# Altium schematic sheet Elreg_Sender.SchDoc
size A; SheetNumber: 2
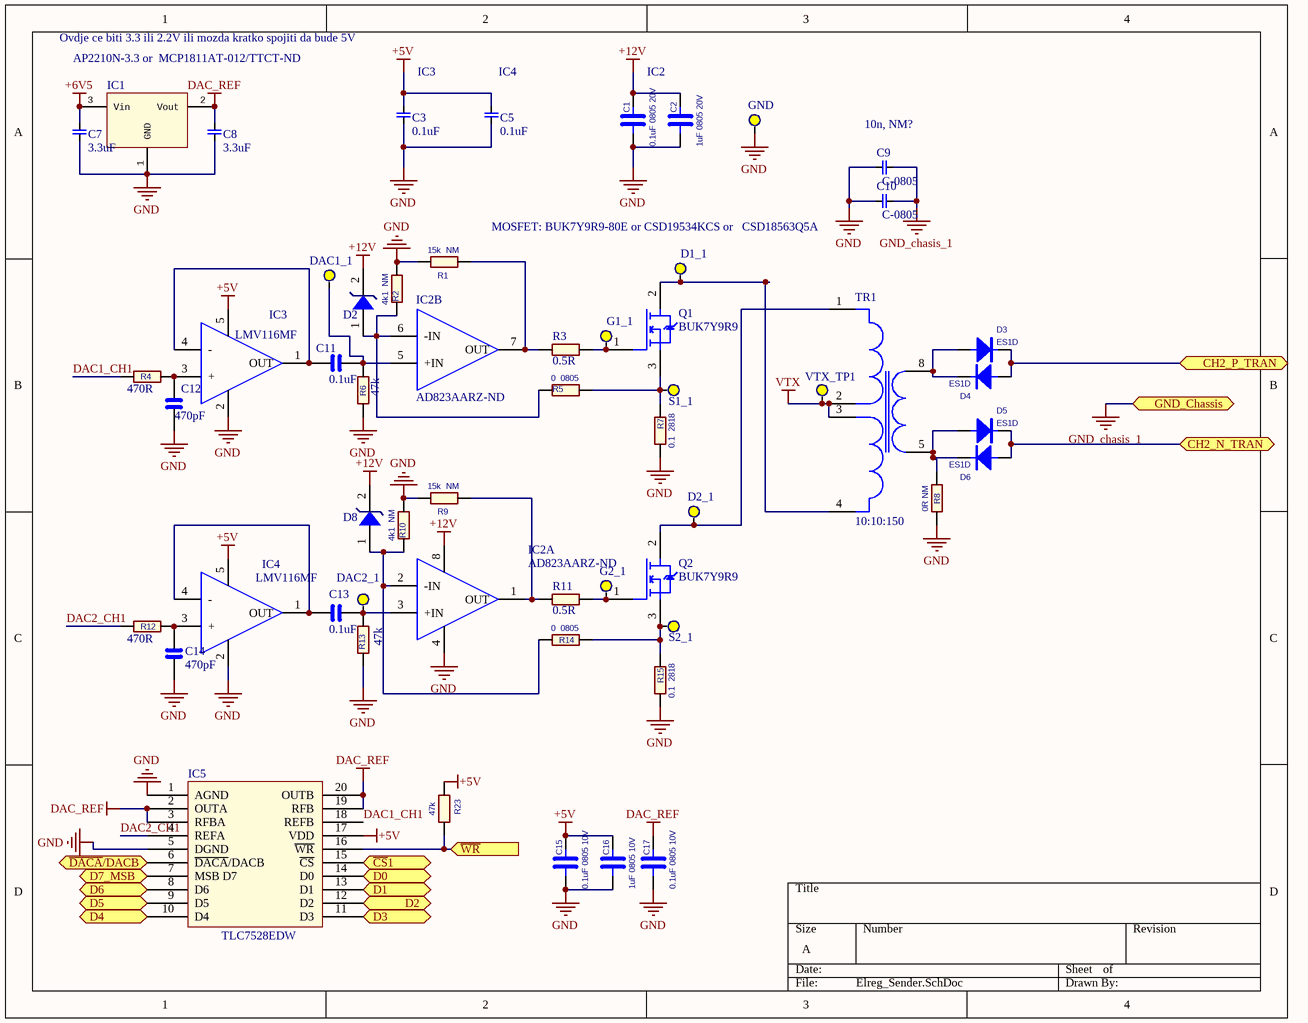
[diagram p0: Elreg_Sender.SchDoc]

## Parts
C1  0.1uF 0805 20V  [C-0603]
C2  1uF 0805 20V  [C-0603]
C3  0.1uF  [C-0603]
C5  0.1uF  [C-0603]
C7  3.3uF  [C-0805]
C8  3.3uF  [C-0805]
C9  C-0805  [C-0805]
C10  C-0805  [C-0805]
C11  0.1uF  [C-0603]
C12  470pF  [C-0603]
C13  0.1uF  [C-0603]
C14  470pF  [C-0603]
C15  0.1uF 0805 10V  [C-0603]
C16  1uF 0805 10V  [C-0603]
C17  0.1uF 0805 10V  [C-0603]
D1_1  Test_Point  [Test_Point]  (value not drawn)
D2  Zener 12V  [DFN380P520X45-2N]  (value not drawn)
D2_1  Test_Point  [Test_Point]  (value not drawn)
D3  ES1D  [SMA]
D4  ES1D  [SMA]
D5  ES1D  [SMA]
D6  ES1D  [SMA]
D8  Zener 12V  [DFN380P520X45-2N]  (value not drawn)
DAC1_1  DAC1  [Test_Point]  (value not drawn)
DAC2_1  DAC2_1  [Test_Point]  (value not drawn)
G1_1  Test_Point  [Test_Point]  (value not drawn)
G2_1  Test_Point  [Test_Point]  (value not drawn)
IC1  AP2210N-3.3 or  MCP1811AT-012/TTCT-ND  [SOT23-3]
IC2  AD823AARZ-ND  [TSOP65P280X110-8N]  (parts A,B of 2)
IC3  LMV116MF  [SOT-23-5]
IC4  LMV116MF  [SOT-23-5]
IC5  TLC7528EDW  [SOIC-20]
Q1  BUK7Y9R9  [BUK7Y9R)]
Q2  BUK7Y9R9  [BUK7Y9R)]
R1  15k  NM  [R-0603]
R2  4k1  NM  [R-0603]
R3  0.5R  [R-0603]
R4  470R  [R-0603]
R5  0  0805  [R-0603]
R6  47k  [R-0603]
R7  0.1  2818  [RES2818]
R8  0R NM  [RES-0805]
R9  15k  NM  [R-0603]
R10  4k1  NM  [R-0603]
R11  0.5R  [R-0603]
R12  470R  [R-0603]
R13  47k  [R-0603]
R14  0  0805  [R-0603]
R15  0.1  2818  [RES2818]
R23  47k  [R-0603]
S1_1  Test_Point  [Test_Point]  (value not drawn)
S2_1  Test_Point  [Test_Point]  (value not drawn)
TP1  GND  [Test_Point]
TR1  10:10:150  [Trafo_15x15]
VTX_TP1  Test_Point  [Test_Point]  (value not drawn)

## Ports
CH2_N_TRAN (bidir), CH2_P_TRAN (bidir), D0 (in), D1 (in), D2 (in), D3 (in), D4 (in), D5 (in), D6 (in), D7_MSB (in), GND_Chassis (bidir), ~{CS}1 (in), ~{DACA}/DACB (in), ~{WR} (in)

## Nets
+5V: C3.2(G) C5.2(G) C15.2 C16.2 IC3.5(+Vs) IC4.5(+Vs) IC5.17(VDD) R23.2
+6V5: C7.2(G) IC1.3(Vin)
+12V: C1.2 C2.2 D2.2(A) D8.2(A) IC2.8(+Vs)
DAC_REF: C8.2(G) C17.2 IC1.2(Vout) IC5.2(OUTA) IC5.3(RFBA) IC5.19(RFB) IC5.20(OUTB)
GND: C1.1 C2.1 C3.1(G) C5.1(G) C7.1(G) C8.1(G) C9.1(G) C10.1(G) C12.2 C14.1 C15.1 C16.1 C17.1 IC1.1(GND) IC2.4(-Vs) IC3.2(-Vs) IC4.2(-Vs) IC5.1(AGND) IC5.5(DGND) R1.1 R2.2 R6.1 R7.2 R8.1 R9.1 R10.2 R13.2 R15.2 TP1.1
GND_chasis_1: C9.2(G) C10.2(G) ; port GND_Chassis
VTX: TR1.2(G) TR1.3(G) VTX_TP1.1
~{CS}1: IC5.15(~{CS}) ; port ~{CS}1
~{DACA}/DACB: IC5.6(~{DACA}/DACB) ; port ~{DACA}/DACB
~{WR}: IC5.16(~{WR}) R23.1 ; port ~{WR}
CH2_N_TRAN: D5.2(C) D6.1(A) ; port CH2_N_TRAN
CH2_P_TRAN: D3.2(C) D4.1(A) ; port CH2_P_TRAN
D0: IC5.14(D0) ; port D0
D1: IC5.13(D1) ; port D1
D2: IC5.12(D2) ; port D2
D3: IC5.11(D3) ; port D3
D4: IC5.10(D4) ; port D4
D5: IC5.9(D5) ; port D5
D6: IC5.8(D6) ; port D6
D7_MSB: IC5.7(MSB_D7) ; port D7_MSB
DAC1_CH1: IC5.18(REFB) R4.1
DAC2_CH1: IC5.4(REFA) R12.1
NetC11_1: C11.1 DAC1_1.1 IC2.5(+IN) R6.2
NetC11_2: C11.2 IC3.1(OUT) IC3.4(-)
NetC12_1: C12.1 IC3.3(+) R4.2
NetC13_1: C13.1 DAC2_1.1 IC2.3(+IN) R13.1
NetC13_2: C13.2 IC4.1(OUT) IC4.4(-)
NetC14_2: C14.2 IC4.3(+) R12.2
NetD1_1_1: D1_1.1 Q1.2(G) TR1.4(G)
NetD2_1: D2.1(A) IC2.6(-IN) R2.1 R5.1
NetD2_1_1: D2_1.1 Q2.2(G) TR1.1(G)
NetD3_1: D3.1(A) D4.2(C) TR1.8(G)
NetD5_1: D5.1(A) D6.2(C) R8.2 TR1.5(G)
NetD8_1: D8.1(A) IC2.2(-IN) R10.1 R14.1
NetG1_1_1: G1_1.1 Q1.1(G) R3.2
NetG2_1_1: G2_1.1 Q2.1(G) R11.2
NetIC2_1: IC2.1(OUT) R9.2 R11.1
NetIC2_7: IC2.7(OUT) R1.2 R3.1
NetQ1_3: Q1.3(G) R5.2 R7.1 S1_1.1
NetQ2_3: Q2.3(G) R14.2 R15.1 S2_1.1

## Notes on the sheet
- Ovdje ce biti 3.3 ili 2.2V ili mozda kratko spojiti da bude 5V
- (near C3) IC3
- (near C5) IC4
- IC2
- (near C9) 10n, NM?
- MOSFET: BUK7Y9R9-80E or CSD19534KCS or   CSD18563Q5A

## Library data of the parts
C1 C2 C15-C17 = 0805CAPxxrrrrv: CAP CER rrrrUF xV x% type 0805
C3 C5 C7 C8 = C-0805_3_3uF: Manufacturer 1: Yageo; Manufacturer Part Number 1: CC1206KKX7RBBB332; Tolerance: ±10%; Voltage - Rated: 500V; Temperature Coefficient: X7R; Notification: Current market demand for these product types have resulted in fluctuating and extending lead times. Lead times may differ.; Description 1: CAP CER 3300PF 500V X7R 1206; Category 1: Capacitors; Packaging: Cut Tape (CT); Part Status: Active; Operating Temperature: -55°C ~ 125°C; Features: -; Ratings: -; Applications: General Purpose; Failure Rate: -; Mounting Type: Surface Mount, MLCC; Package / Case: 1206 (3216 Metric); Size / Dimension: 0.126" L x 0.063" W (3.20mm x 1.60mm); Height - Seated (Max): -; Thickness (Max): 0.057" (1.45mm); Lead Spacing: -; Lead Style: -; ComponentLink1URL: http://www.yageo.com/documents/recent/UPY-NP0X7R_MV_100-to-630V_21.pdf; ComponentLink1Description: http://www.yageo.com/documents/recent/UPY-NP0X7R_MV_100-to-630V_21.pdf; Supplier 1: Digi-Key; Supplier Part Number 1: 311-1506-1-ND; RoHS 1: RoHS Compliant; Stock 1: 4928; Pricing 1: 1=0.31, 10=0.214, 100=0.1085, 500=0.07424, 1000=0.06568 (USD)
C9 C10 = C-0805: Manufacturer 1: Yageo; Manufacturer Part Number 1: CC1206KKX7RBBB332; Tolerance: ±10%; Voltage - Rated: 500V; Temperature Coefficient: X7R; Notification: Current market demand for these product types have resulted in fluctuating and extending lead times. Lead times may differ.; Description 1: CAP CER 3300PF 500V X7R 1206; Category 1: Capacitors; Packaging: Cut Tape (CT); Part Status: Active; Operating Temperature: -55°C ~ 125°C; Features: -; Ratings: -; Applications: General Purpose; Failure Rate: -; Mounting Type: Surface Mount, MLCC; Package / Case: 1206 (3216 Metric); Size / Dimension: 0.126" L x 0.063" W (3.20mm x 1.60mm); Height - Seated (Max): -; Thickness (Max): 0.057" (1.45mm); Lead Spacing: -; Lead Style: -; ComponentLink1URL: http://www.yageo.com/documents/recent/UPY-NP0X7R_MV_100-to-630V_21.pdf; ComponentLink1Description: http://www.yageo.com/documents/recent/UPY-NP0X7R_MV_100-to-630V_21.pdf; Supplier 1: Digi-Key; Supplier Part Number 1: 311-1506-1-ND; RoHS 1: RoHS Compliant; Stock 1: 4928; Pricing 1: 1=0.31, 10=0.214, 100=0.1085, 500=0.07424, 1000=0.06568 (USD)
C11 C13 = C-0603_0_1u_10V: CAP CER 0.1UF 10V X7R 0603; Manufacturer Part Number: 885012206020
C12 C14 = C-0603_470p_10V: CAP CER 470p 10V C0G/NP0 0603; Manufacturer Part Number: 885012006014
D2 D8 = Zener 12V: Manufacturer 1: Comchip Technology; Manufacturer Part Number 1: CDBA140-G; Description 1: DIODE SCHOTTKY 40V 1A DO214AC; Category 1: Discrete Semiconductor Products; Diode Type: Schottky; Current - Average Rectified (Io): 1A; Speed: Fast Recovery =< 500ns, > 200mA (Io); Supplier 1: Digi-Key; Supplier Part Number 1: 641-1015-1-ND; RoHS 1: RoHS Compliant; Stock 1: 527910; Pricing 1: 1=0.37, 10=0.338, 100=0.1893, 500=0.1014, 1000=0.06895 (USD); Packaging: Cut Tape (CT); Part Status: Active; Capacitance @ Vr, F: -; Mounting Type: Surface Mount; Package / Case: DO-214AC, SMA; Supplier Device Package: DO-214AC (SMA); Operating Temperature - Junction: -65°C ~ 125°C; Base Part Number: CDBA140; ComponentLink1URL: http://www.comchiptech.com/admin/files/product/CDBA140-HF%20Thru192841.%20CDBA1100-HF%20RevB.pdf; ComponentLink1Description: http://www.comchiptech.com/admin/files/product/CDBA140-HF%20Thru192841.%20CDBA1100-HF%20RevB.pdf
D3-D6 = ES1x: Diode; Manufacturer: Fairchild/ON Semiconductor; Diode Type: Standard; Voltage - DC Reverse (Vr) (Max): 200V; Current - Average Rectified (Io): 1A; Voltage - Forward (Vf) (Max) @ If: 920mV @ 1A; Speed: Fast Recovery =< 500ns, > 200mA (Io); Reverse Recovery Time (trr): 15ns; Current - Reverse Leakage @ Vr: 5μA @ 200V; Capacitance @ Vr, F: 7pF @ 4V, 1MHz; Supplier 1: Digi-Key; Supplier Part Number 1: ES1DFSTR-ND; Manufacturer Part Number: ES1D; RoHS: RoHS Compliant; Category: Discrete Semiconductor Products; Stock 1: 135000; Pricing 1: 7500=0.0567, 15000=0.0504, 37500=0.04725, 52500=0.0419, 187500=0.04032 (USD); Packaging: Tape & Reel (TR); Part Status: Active; Mounting Type: Surface Mount; Package / Case: DO-214AC, SMA; Supplier Device Package: SMA (DO-214AC); Operating Temperature - Junction: -55°C ~ 150°C; ComponentLink1URL: https://www.fairchildsemi.com/datasheets/ES/ES1A.pdf; ComponentLink1Description: https://www.fairchildsemi.com/datasheets/ES/ES1A.pdf
DAC1_1 DAC2_1 TP1 = Test_Point
IC1 = AP2210N-3.3: AP2210N-3.3TRG1DICT-ND
IC2 = AD823AARZ-ND: IC OPAMP JFET 16MHZ RRO 8-MSOP; Supplier 1: Digi-Key; Supplier Part Number 1: AD823ARZ-ND
R1 R2 R5 R8-R10 R14 R23 = CRCW0805xxxxJN Default: RES xx OHM 1/8W 5% 0805 SMD; Category 1: Resistors
R3 R11 = RES-0805
R4 R12 = R-0603_470R: RES SMD 470 OHM 1% 0.4W 0805; Manufacturer 1: Vishay Dale; Manufacturer Part Number 1: CRCW0805150RJNEA; Manufacturer Part Number: ESR10EZPF1001; Description 1: RES 150 OHM 1/8W 5% 0805 SMD; Category 1: Resistors; Tolerance: ±5%; Power (Watts): 0.125W, 1/8W; Temperature Coefficient: ±200ppm/°C; Description 2: Thick Film Resistors - SMD 1/8watt 150ohms 5% 200ppm; Category 2: Thick Film Resistors - SMD; Power Rating: 125 mW (1/8 W); Resistance: 150 Ohms; Voltage Rating: 150 V; Description 3: VISHAY DALE - CRCW0805150RJNEA - RESISTOR, THICK FILM, 150 OHM, 125mW, 5%; Product Range: VISHAY - CRCW Series; Resistance Tolerance: ± 5%; Resistor Case Style: 0805 ^2012 Metric]; Resistor Element Type: Thick Film; No. of Pins: 2; Resistance (Ohms): 150; Supplier 1: Digi-Key; Supplier Part Number 1: 541-150ADKR-ND; RoHS 1: RoHS Compliant; Packaging: Digi-Reel®; Composition: Thick Film; Features: Automotive AEC-Q200 Qualified; Package / Case: 0805 (2012 Metric); Supplier Device Package: 0805 (2012 Metric); Size / Dimension: 0.079" L x 0.049" W (2.00mm x 1.25mm); Height: 0.020" (0.50mm); ComponentLink1URL: http://www.vishay.com/doc?20035; ComponentLink1Description: http://www.vishay.com/doc?20035; Supplier 2: Mouser; Supplier Part Number 2: 71-CRCW0805150RJNEA; Manufacturer 2: Vishay; Manufacturer Part Number 2: CRCW0805150RJNEA; RoHS 2: RoHS Compliant By Exemption; Dimensions: 1.25 mm W x 2 mm L x 0.45 mm H; Operating Temperature Range: - 55 C to + 155 C; Product: Thick Film Resistors SMD; Series: CRCW; Termination Style: SMD/SMT; Case Code - in: 0805; Case Code - mm: 2012; Product Category: 0805 Thick Film Chip Resistors; Standard Pack Qty: 5000; RoHS - Mouser: E; Minimum Order Quantity: 1; Reeling: True; ComponentLink2URL: http://www.mouser.com/ds/2/427/dcrcwe3-109170.pdf; ComponentLink2Description: http://www.mouser.com/ds/2/427/dcrcwe3-109170.pdf; Supplier 3: Farnell; Supplier Part Number 3: 1514819; Manufacturer 3: VISHAY DALE; Manufacturer Part Number 3: CRCW0805150RJNEA; RoHS 3: YES; ComponentLink3URL: http://www.farnell.com/cad/1552534.zip; ComponentLink3Description: http://www.farnell.com/cad/1552534.zip
R6 R13 = R-0603_47k: RES SMD 47k 1% 0.4W 0805; Manufacturer 1: Vishay Dale; Manufacturer Part Number 1: CRCW0805150RJNEA; Manufacturer Part Number: ESR10EZPF1001; Description 1: RES 150 OHM 1/8W 5% 0805 SMD; Category 1: Resistors; Tolerance: ±5%; Power (Watts): 0.125W, 1/8W; Temperature Coefficient: ±200ppm/°C; Description 2: Thick Film Resistors - SMD 1/8watt 150ohms 5% 200ppm; Category 2: Thick Film Resistors - SMD; Power Rating: 125 mW (1/8 W); Resistance: 150 Ohms; Voltage Rating: 150 V; Description 3: VISHAY DALE - CRCW0805150RJNEA - RESISTOR, THICK FILM, 150 OHM, 125mW, 5%; Product Range: VISHAY - CRCW Series; Resistance Tolerance: ± 5%; Resistor Case Style: 0805 ^2012 Metric]; Resistor Element Type: Thick Film; No. of Pins: 2; Resistance (Ohms): 150; Supplier 1: Digi-Key; Supplier Part Number 1: 541-150ADKR-ND; RoHS 1: RoHS Compliant; Packaging: Digi-Reel®; Composition: Thick Film; Features: Automotive AEC-Q200 Qualified; Package / Case: 0805 (2012 Metric); Supplier Device Package: 0805 (2012 Metric); Size / Dimension: 0.079" L x 0.049" W (2.00mm x 1.25mm); Height: 0.020" (0.50mm); ComponentLink1URL: http://www.vishay.com/doc?20035; ComponentLink1Description: http://www.vishay.com/doc?20035; Supplier 2: Mouser; Supplier Part Number 2: 71-CRCW0805150RJNEA; Manufacturer 2: Vishay; Manufacturer Part Number 2: CRCW0805150RJNEA; RoHS 2: RoHS Compliant By Exemption; Dimensions: 1.25 mm W x 2 mm L x 0.45 mm H; Operating Temperature Range: - 55 C to + 155 C; Product: Thick Film Resistors SMD; Series: CRCW; Termination Style: SMD/SMT; Case Code - in: 0805; Case Code - mm: 2012; Product Category: 0805 Thick Film Chip Resistors; Standard Pack Qty: 5000; RoHS - Mouser: E; Minimum Order Quantity: 1; Reeling: True; ComponentLink2URL: http://www.mouser.com/ds/2/427/dcrcwe3-109170.pdf; ComponentLink2Description: http://www.mouser.com/ds/2/427/dcrcwe3-109170.pdf; Supplier 3: Farnell; Supplier Part Number 3: 1514819; Manufacturer 3: VISHAY DALE; Manufacturer Part Number 3: CRCW0805150RJNEA; RoHS 3: YES; ComponentLink3URL: http://www.farnell.com/cad/1552534.zip; ComponentLink3Description: http://www.farnell.com/cad/1552534.zip
R7 R15 = CRCW0805xxxxJN Default: 0.1Ohm 10W; Manufacturer part number:: WSHP2818R1000FEB
TR1 = TRAFO_15x15: Coil Forme: B66414B6008T001; Yoke: B66414B2000X000; Cover Plate: B66414A7000X000; link PDF: https://www.tdk-electronics.tdk.com/inf/80/db/fer/efd_15_8_5.pdf